# EAGLE design lat_encamp_v2_axial (EAGLE 9.6.2)
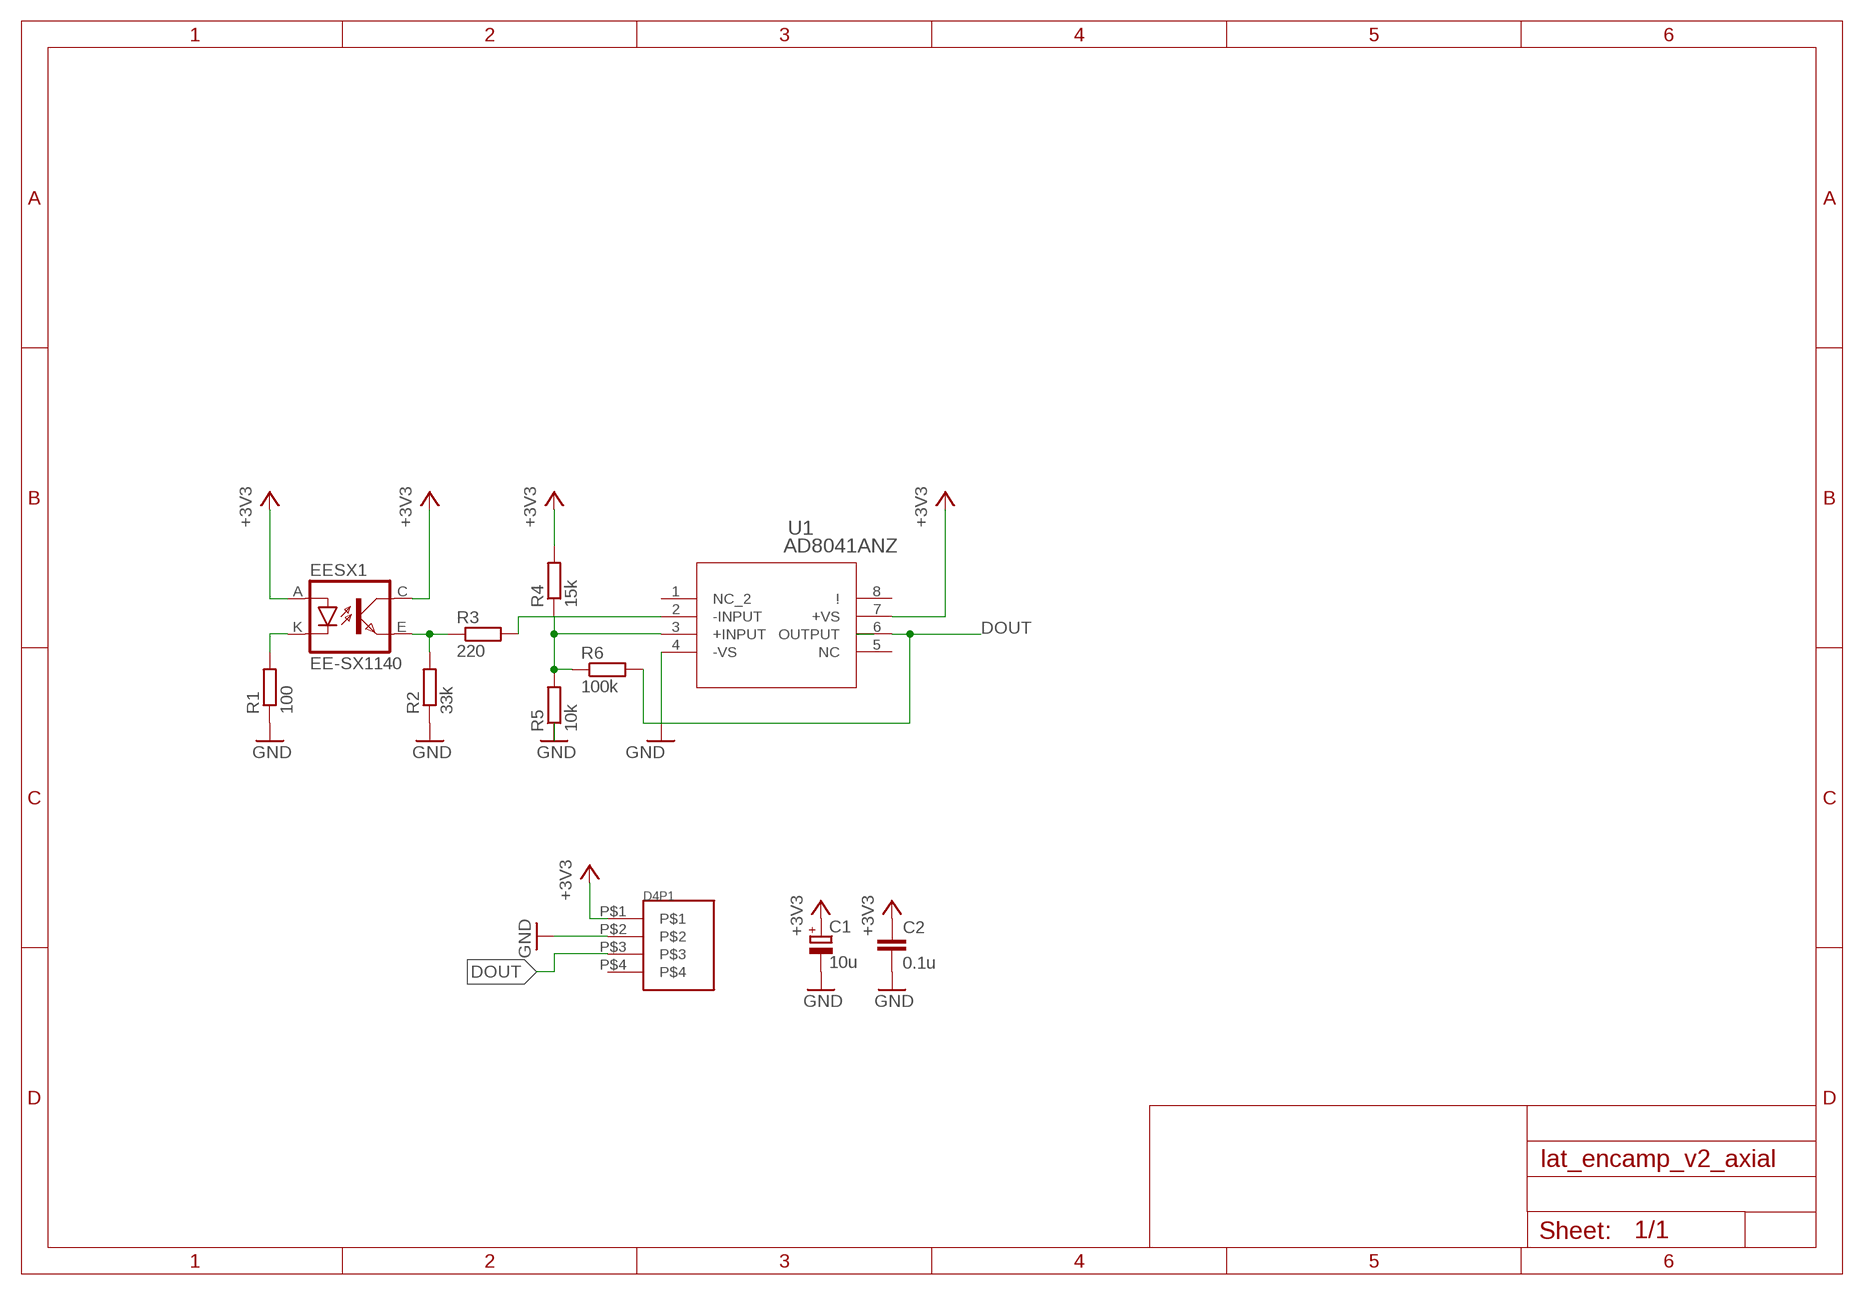
[diagram p0: schematic, sheet 1]

## Parts
C1  10u  CPOL-EUE2,5-6E  [E2,5-6E]
C2  0.1u  C-EU050-024X044  [C050-024X044]
D4P1  DF1E-4P  [DF1E-4P]
EESX1  EE-SX1140  [EE-SX1140]
R1  100  R-EU_0204/7  [0204/7]
R2  33k  R-EU_0204/7  [0204/7]
R3  220  R-EU_0204/7  [0204/7]
R4  15k  R-EU_0204/7  [0204/7]
R5  10k  R-EU_0204/7  [0204/7]
R6  100k  R-EU_0204/7  [0204/7]
U1  AD8041ANZ  [N_8_ADI]

## Nets
+3V3: C1.+ C2.1 D4P1.P$1 EESX1.A EESX1.C(COL) R4.2 U1.7(+VS)
DOUT: D4P1.P$3 R6.2 U1.6(OUTPUT)
GND: C1.- C2.2 D4P1.P$2 R1.1 R2.1 R5.1 U1.4(-VS)
N$1: R3.2 U1.2(-INPUT)
N$3: R4.1 R5.2 R6.1 U1.3(+INPUT)
N$4: EESX1.E(EMIT) R2.2 R3.1
N$5: EESX1.K(C) R1.2
Unconnected: D4P1.P$4 U1.1(NC_2) U1.5(NC) U1.8(!)

## Library data of the parts
C1 = rcl:CPOL-EU: POLARIZED CAPACITOR, European symbol; SPICEPREFIX: C
C2 = rcl:C-EU: CAPACITOR, European symbol; SPICEPREFIX: C
D4P1 = lib_test:DF1E-4P
EESX1 = lib_test:EE-SX1140
R1-R6 = rcl:R-EU_: RESISTOR, European symbol; SPICEPREFIX: R
U1 = lib_test:AD8041ANZ; BUILT_BY: EMA_UL_Team; MANUFACTURER_PART_NUMBER: AD8041ANZ; SOURCELIBRARY: Analog_2012-01-01_5; VENDOR: Analog Devices Inc

## Board
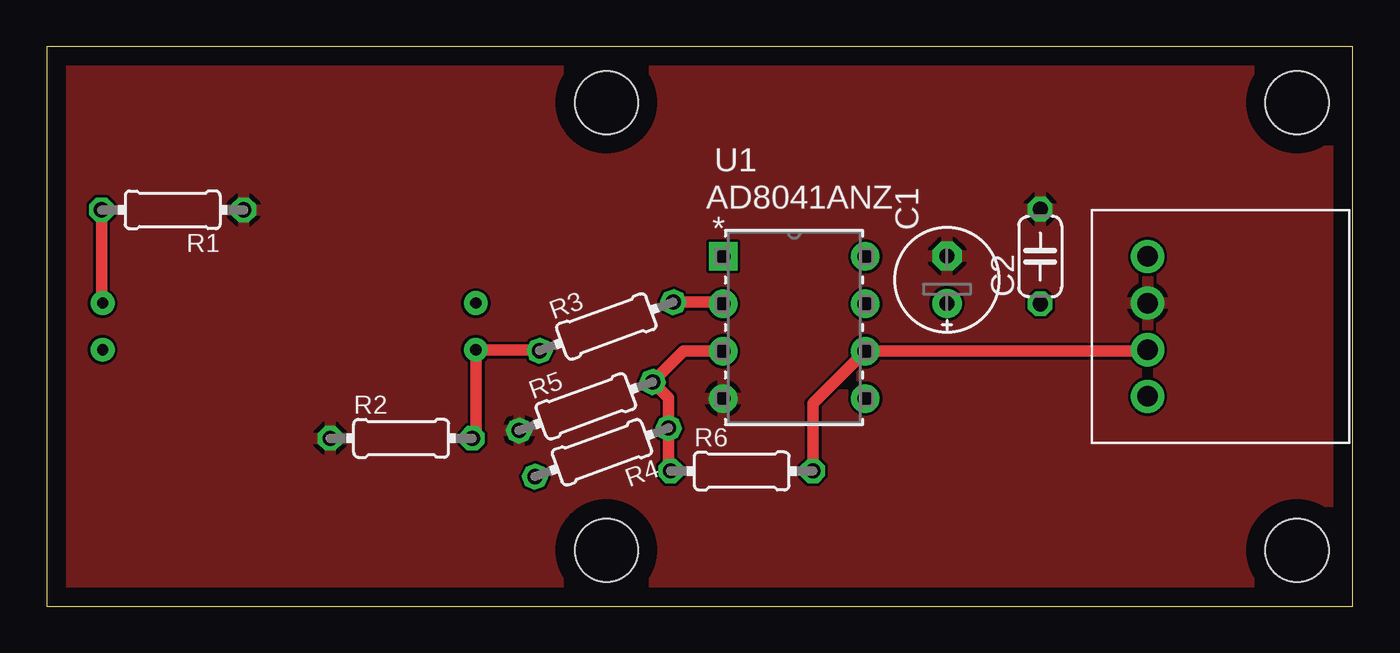
[diagram p1: board, top side]
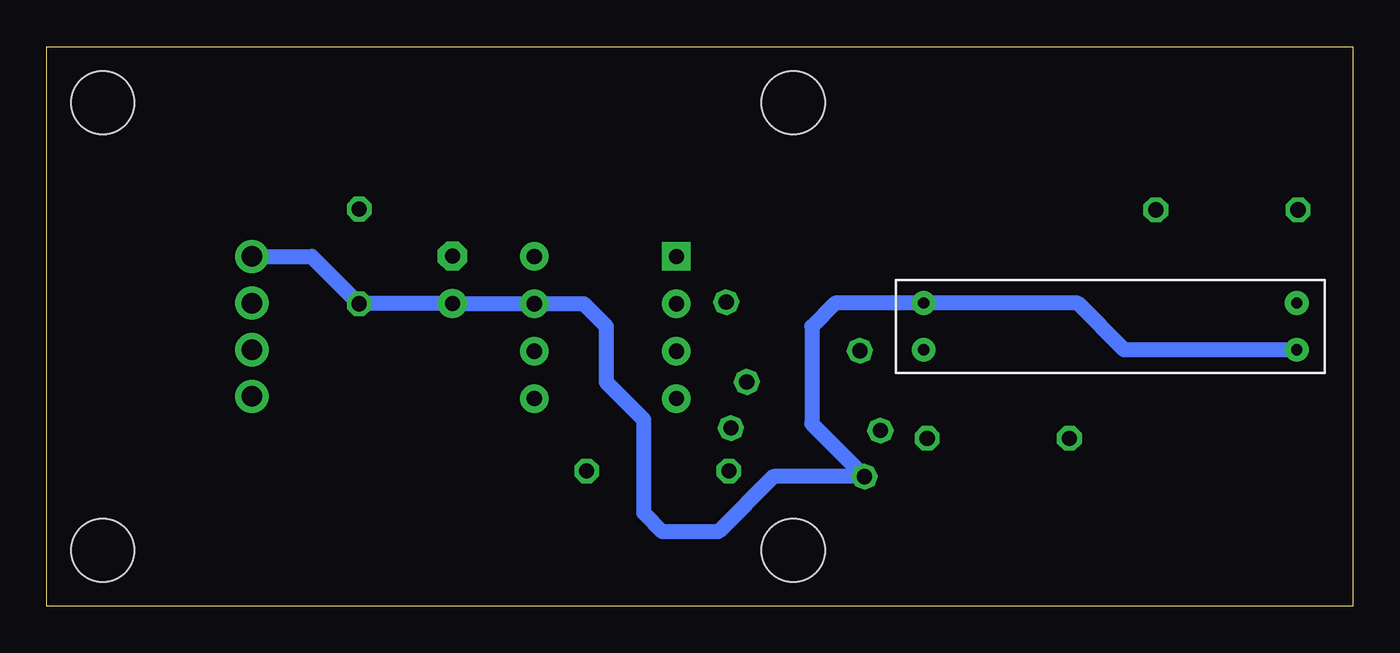
[diagram p2: board, bottom side, seen from below]

Size 70 x 30 mm. Coordinates in mm from the lower left corner, seen from the top.
Outline: 0,0 70,0 70,30 0,30 0,0
Copper layers (1*16): Top 0.035mm / dielectric 1.5mm / Bottom 0.035mm
Design rules "default": minimum track width 6mil, minimum drill 0.35mm, track to track 6mil, track to pad 6mil, pad to pad 6mil, via to via 6mil, smd to smd 6mil, copper to edge 40mil, drill to drill 6mil, minimum pad ring 10mil, minimum via ring 8mil, stop-mask expansion 4mil, vias tented up to drill 0mil, thermal gap 10mil
Holes 3.4 mm at 67,27 30,27 30,3 67,3

### Footprints (pad centres in the part's own frame; a part is rotated, then mirrored left to right if it is on the bottom)
E2,5-6E = drill 0.813 pad 1.575: + -1.27,0 | drill 0.813 pad 1.575 octagon: - 1.27,0
C050-024X044 = drill 0.813 octagon: 1 -2.54,0; 2 2.54,0
DF1E-4P = drill 1.1 pad 1.778: P$1 0,3.75; P$2 0,1.25; P$3 0,-1.25; P$4 0,-3.75
EE-SX1140 = drill 0.6 pad 1.27: A 1.25,10; C -1.25,-10; E 1.25,-10; K -1.25,10
0204/7 = drill 0.813 octagon: 1 -3.81,0; 2 3.81,0
N_8_ADI = drill 0.813 pad 1.524 square: 1 0,0 | drill 0.813 pad 1.524: 2 0,-2.54; 3 0,-5.08; 4 0,-7.62; 5 7.62,-7.62; 6 7.62,-5.08; 7 7.62,-2.54; 8 7.62,0

### Placement (x,y rotation side)
C1  48.25,17.5 90 top
C2  53.25,18.75 90 top
D4P1  59,15 0 top
EESX1  13,15 270 bottom
R1  6.75,21.25 180 top
R2  19,9 0 top
R3  30,15 20 top
R4  29.75,8.25 200 top
R5  28.9,10.72 20 top
R6  37.25,7.25 0 top
U1  36.25,18.75 0 top

### Tracks (layer width: path | path; a pad name or v marks a point on that pad's centre or on a via)
+3V3
  Bottom 0.813: EESX1.A 12.25,13.75 14.75,16.25 EESX1.C 27.75,16.25 29,15 29,9.78 R4.2 31.05,6.95 34,4 37,4 38,5 38,10 40,12 40,15 41.21,16.21 U1.7 48.23,16.21 C1.+ 53.23,16.23 C2.1 | C2.1 53.27,16.23 | D4P1.P$1 55.79,18.75 C2.1
DOUT
  Top 0.61: D4P1.P$3 58.92,13.67 U1.6 41.06,10.86 R6.2
GND
  pour Top: 0,30 0,0 70,0 70,30
N$1
  Top 0.61: R3.2 36.16,16.3 U1.2
N$3
  Top 0.61: U1.3 34.13,13.67 R5.2 33.33,11.17 R4.1 33.33,7.36 R6.1
N$4
  Top 0.61: R3.1 26.37,13.75 EESX1.E 23,9.19 R2.2
N$5
  Top 0.61: EESX1.K 2.94,16.31 R1.2